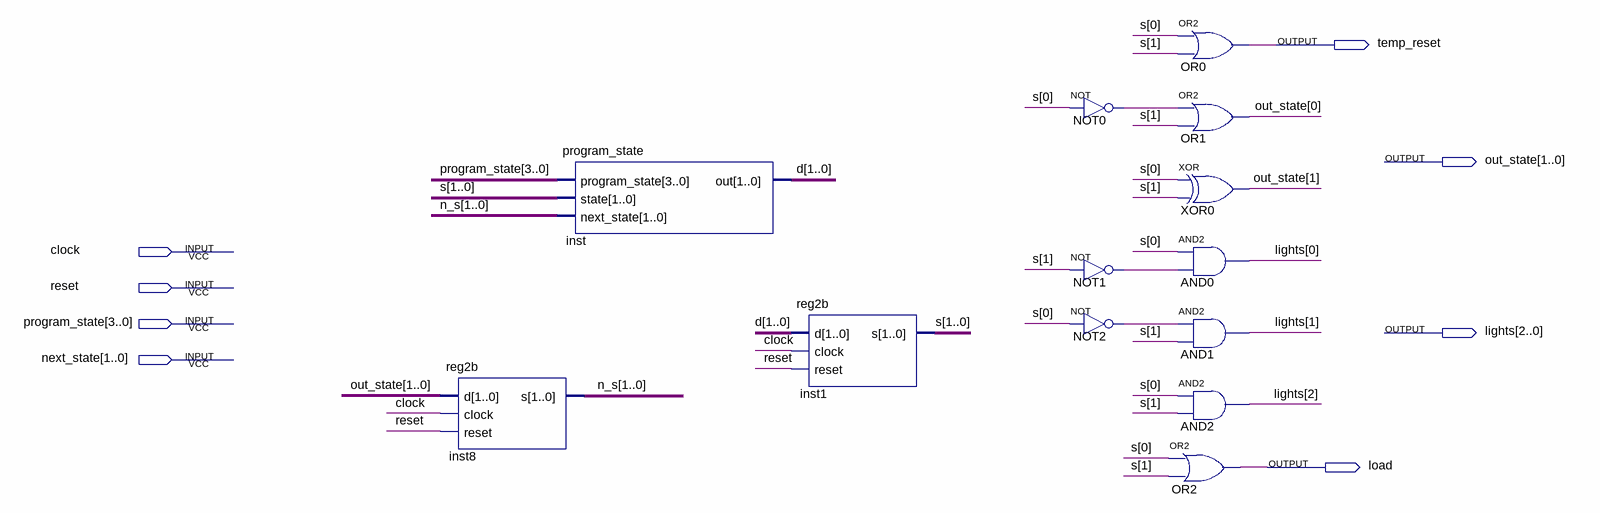
[diagram p0: schematic sheet]
// Quartus schematic fsm_lights.bdf as structural Verilog: 13 symbols, 8 pins
module fsm_lights (
  input  clock,
  input  reset,
  input  [3:0] program_state,
  input  [1:0] next_state,
  output temp_reset,
  output [1:0] out_state,
  output [2:0] lights,
  output load
);

  wire NOT0_out, NOT1_out, NOT2_out;
  wire [1:0] d, n_s, s;

  reg2b inst8 (.d(out_state), .clock(clock), .reset(reset), .s(n_s));
  program_state inst (.program_state(program_state), .state(s), .next_state(n_s), .out(d));
  reg2b inst1 (.d(d), .clock(clock), .reset(reset), .s(s));
  not NOT0 (NOT0_out, s[0]);
  not NOT1 (NOT1_out, s[1]);
  not NOT2 (NOT2_out, s[0]);
  or OR0 (temp_reset, s[0], s[1]);
  or OR1 (out_state[0], NOT0_out, s[1]);
  xor XOR0 (out_state[1], s[0], s[1]);
  and AND0 (lights[0], s[0], NOT1_out);
  and AND1 (lights[1], NOT2_out, s[1]);
  and AND2 (lights[2], s[0], s[1]);
  or OR2 (load, s[0], s[1]);
endmodule
